# EAGLE design ISP (EAGLE 9.5.1)
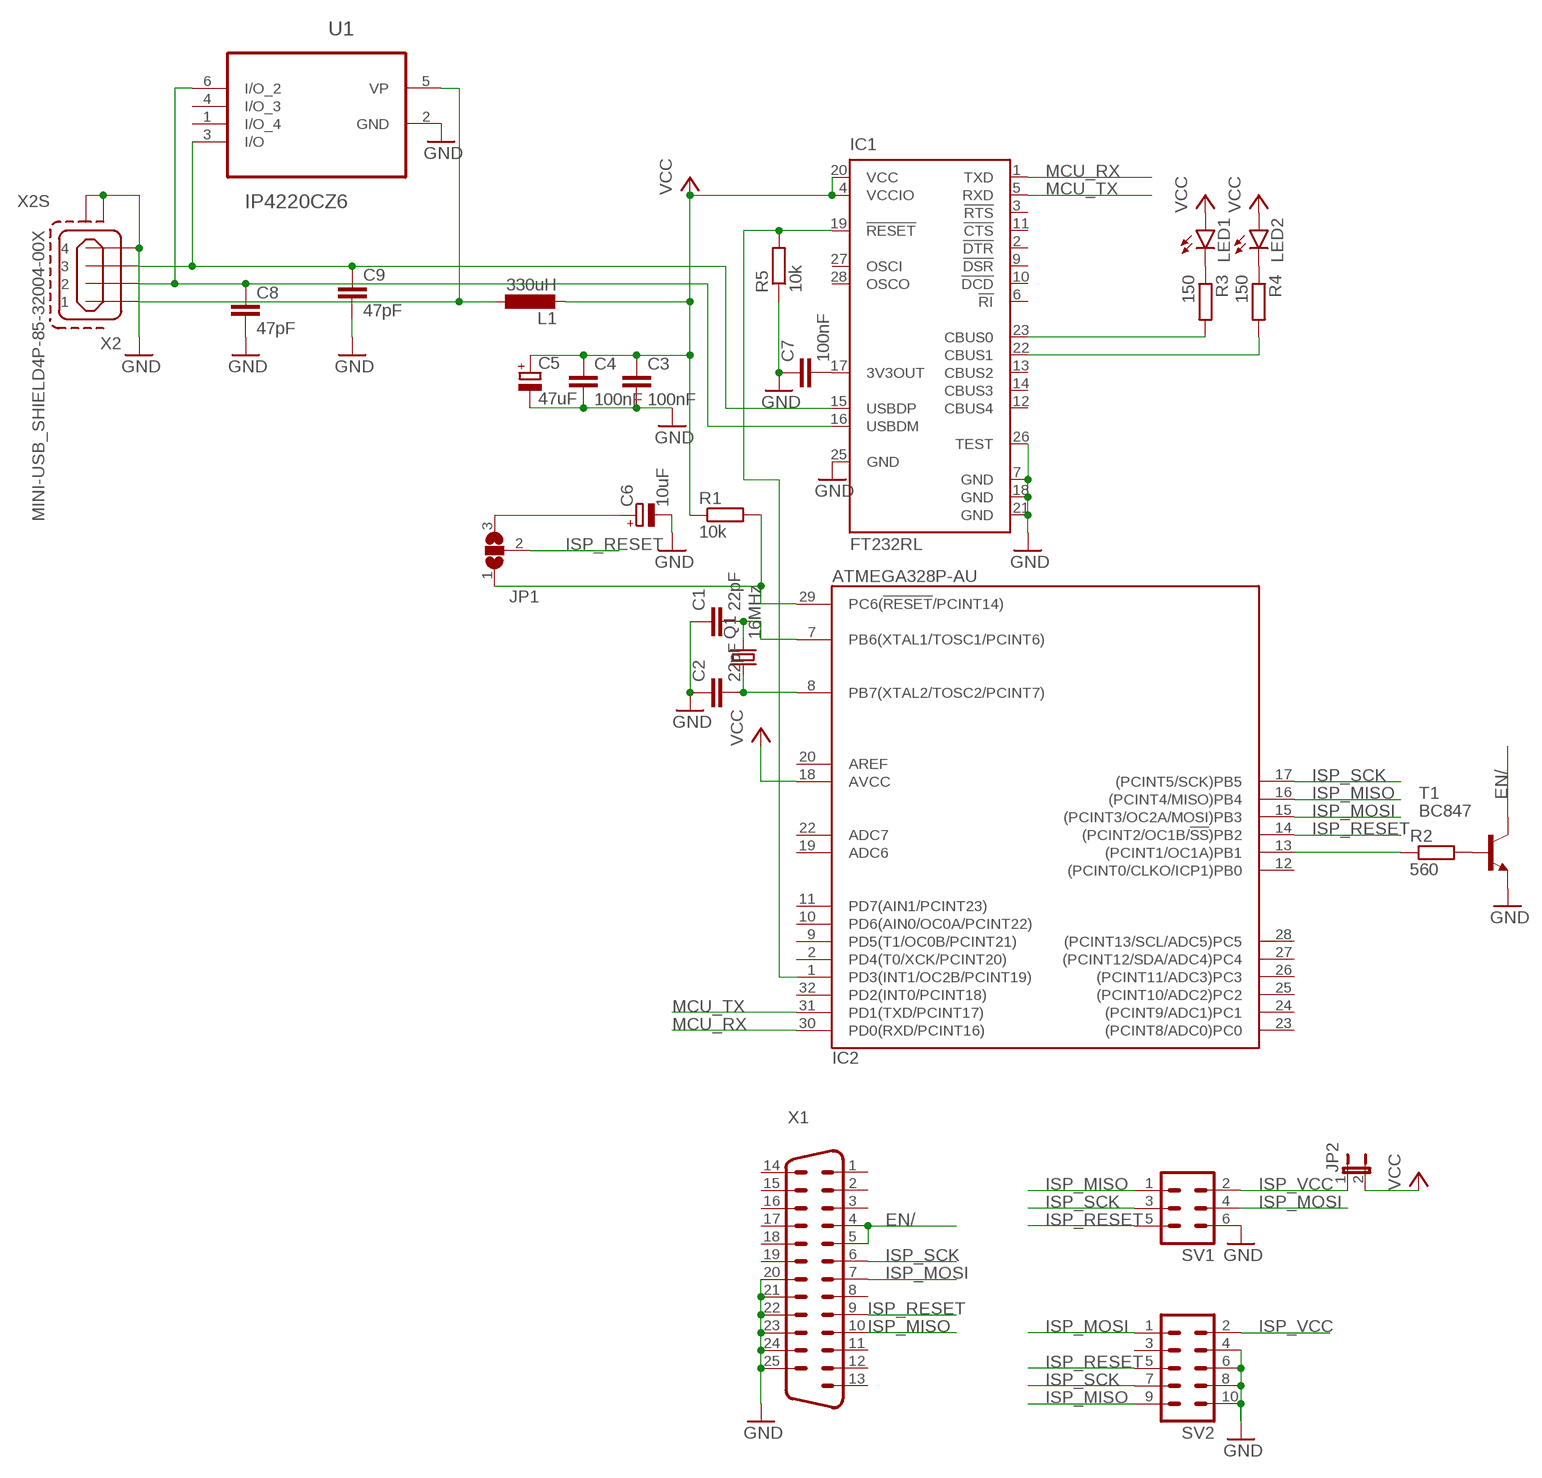
[diagram p0: schematic, sheet 1]

## Parts
C1  22pF  C-EUC0805  [C0805]
C2  22pF  C-EUC0805  [C0805]
C3  100nF  C-EUC0805  [C0805]
C4  100nF  C-EUC0805  [C0805]
C5  47uF  CPOL-EUD  [PANASONIC_D]
C6  10uF  CPOL-EUC  [PANASONIC_C]
C7  100nF  C-EUC0805  [C0805]
C8  47pF  C-EUC0805  [C0805]
C9  47pF  C-EUC0805  [C0805]
IC1  FT232RL  [SSOP28]
IC2  ATMEGA328P-AU  [QFP32_7X7_0.80]
JP1  SJ2W  [SJ_2]
JP2  JP1E  [JP1]
L1  330uH  L-EUL1812  [L1812]
LED1  LEDCHIPLED_1206  [CHIPLED_1206]
LED2  LEDCHIPLED_1206  [CHIPLED_1206]
Q1  16MHz  CRYSTALHC49UP  [HC49UP]
R1  10k  R-EU_R0805  [R0805]
R2  560  R-EU_R0805  [R0805]
R3  150  R-EU_R0805  [R0805]
R4  150  R-EU_R0805  [R0805]
R5  10k  R-EU_R0805  [R0805]
SV1  ML6  [ML6]
SV2  ML10  [ML10]
T1  BC847  [SOT23]
U1  IP4220CZ6  [SOT95P275X110-6N]
X1  M25HP  [M25HP]
X2  MINI-USB_SHIELD4P-85-32004-00X  [85-32004-00X]

## Nets
EN/: T1.3(C) X1.4 X1.5
GND: C1.1 C2.1 C3.2 C4.2 C5.- C6.- C7.1 C8.2 C9.2 IC1.7(GND) IC1.18(GND) IC1.21(GND) IC1.25(GND) IC1.26(TEST) R5.1 SV1.6 SV2.4 SV2.6 SV2.8 SV2.10 T1.2(E) U1.2(GND) X1.20 X1.21 X1.22 X1.23 X1.24 X1.25 X2.4 X2.M1(S1) X2.M2(S2)
ISP_MISO: IC2.16((PCINT4/MISO)PB4) SV1.1 SV2.9 X1.10
ISP_MOSI: IC2.15((PCINT3/OC2A/MOSI)PB3) SV1.4 SV2.1 X1.7
ISP_RESET: IC2.14((PCINT2/OC1B/!SS!)PB2) JP1.2 SV1.5 SV2.5 X1.9
ISP_SCK: IC2.17((PCINT5/SCK)PB5) SV1.3 SV2.7 X1.6
ISP_VCC: JP2.1 SV1.2 SV2.2
MCU_RX: IC1.1(TXD) IC2.30(PD0(RXD/PCINT16))
MCU_TX: IC1.5(RXD) IC2.31(PD1(TXD/PCINT17))
N$1: IC2.29(PC6(!RESET!/PCINT14)) JP1.1 R1.2
N$2: C6.+ JP1.3
N$3: C1.2 IC2.7(PB6(XTAL1/TOSC1/PCINT6)) Q1.2
N$4: C9.1 IC1.15(USBDP) U1.3(I/O) X2.3
N$5: IC2.13((PCINT1/OC1A)PB1) R2.1
N$6: R2.2 T1.1(B)
N$7: C8.1 IC1.16(USBDM) U1.6(I/O_2) X2.2
N$8: C7.2 IC1.17(3V3OUT)
N$9: C2.2 IC2.8(PB7(XTAL2/TOSC2/PCINT7)) Q1.1
N$10: LED2.C R4.1
N$11: LED1.C R3.1
N$12: IC1.23(CBUS0) R3.2
N$13: IC1.22(CBUS1) R4.2
N$14: L1.1 U1.5(VP) X2.1
N$15: IC1.19(!RESET) IC2.1(PD3(INT1/OC2B/PCINT19)) R5.2
VCC: C3.1 C4.1 C5.+ IC1.4(VCCIO) IC1.20(VCC) IC2.18(AVCC) JP2.2 L1.2 LED1.A LED2.A R1.1
Unconnected: IC1.2(!DTR) IC1.3(!RTS) IC1.6(!RI) IC1.9(!DSR) IC1.10(!DCD) IC1.11(!CTS) IC1.12(CBUS4) IC1.13(CBUS2) IC1.14(CBUS3) IC1.27(OSCI) IC1.28(OSCO) IC2.2(PD4(T0/XCK/PCINT20)) IC2.9(PD5(T1/OC0B/PCINT21)) IC2.10(PD6(AIN0/OC0A/PCINT22)) IC2.11(PD7(AIN1/PCINT23)) IC2.12((PCINT0/CLKO/ICP1)PB0) IC2.19(ADC6) IC2.20(AREF) IC2.22(ADC7) IC2.23((PCINT8/ADC0)PC0) IC2.24((PCINT9/ADC1)PC1) IC2.25((PCINT10/ADC2)PC2) IC2.26((PCINT11/ADC3)PC3) IC2.27((PCINT12/SDA/ADC4)PC4) IC2.28((PCINT13/SCL/ADC5)PC5) IC2.32(PD2(INT0/PCINT18)) SV2.3 U1.1(I/O_4) U1.4(I/O_3) X1.1 X1.2 X1.3 X1.8 X1.11 X1.12 X1.13 X1.14 X1.15 X1.16 X1.17 X1.18 X1.19

## Power pins joined to a net without a drawn wire
GND: IC2.3(GND) IC2.5(GND) IC2.21(GND)
VCC: IC2.4(VCC) IC2.6(VCC)

## Library data of the parts
C1-C4 C7-C9 = resistor:C-EU: CAPACITOR, European symbol
C5 C6 = resistor:CPOL-EU: POLARIZED CAPACITOR, European symbol
IC1 = ftdichip:FT232R: Source: http://www.ftdichip.com/Documents/DataSheets/DS_FT232R_v104.pdf; MPN: FT232RL; OC_FARNELL: 1146032; OC_NEWARK: 91K9918
IC2 = atmel:ATMEGA*8: 8-bit AVR Microcontroller 4/8/16/32 kbytes flash 512/1k/1k/2k bytes SRAM 256/512/512/1k bytes EEPROM USART, 6/8-channel 10 bit ADC Pin compatible with Atmega8(L,A) Note: ADC6 and ADC7 are not available in 28-lead packages
JP1 = jumper:SJ2W: SMD solder JUMPER
JP2 = jumper:JP1E: JUMPER
L1 = resistor:L-EU: INDUCTOR, European symbol
LED1 LED2 = led:LED: LED OSRAM: - CHIPLED LG R971, LG N971, LY N971, LG Q971, LY Q971, LO R971, LY R971 LH N974, LH R974 LS Q976, LO Q976, LY Q976 LO Q996 - Hyper CHIPLED LW Q18S LB Q993, LB Q99A, LB R99A - SideLED LS A670, LO A670, LY A670, LG A670, LP A670 LB A673, LV A673, LT A673, LW A673 LH A674 LY A675 LS A676, LA A676, LO A676, LY A676, LW A676 LS A679, LY A679, LG A679 - Hyper Micro SIDELED® LS Y876, LA Y876, LO Y876, LY Y876 LT Y87S - SmartLED LW L88C, LW L88S LB L89C, LB L89S, LG L890 LS L89K, LO L89K, LY L89K LS L896, LA L896, LO L896, LY L896 - TOPLED LS T670, LO T670, LY T670, LG T670, LP T670 LSG T670, LSP T670, LSY T670, LOP T670, LYG T670 LG T671, LOG T671, LSG T671 LB T673, LV T673, LT T673, LW T673 LH T674 LS T676, LA T676, LO T676, LY T676, LB T676, LH T676, LSB T676, LW T676 LB T67C, LV T67C, LT T67C, LS T67K, LO T67K, LY T67K, LW E67C LS E67B, LA E67B, LO E67B, LY E67B, LB E67C, LV E67C, LT E67C LW T67C LS T679, LY T679, LG T679 LS T770, LO T770, LY T770, LG T770, LP T770 LB T773, LV T773, LT T773, LW T773 LH T774 LS E675, LA E675, LY E675, LS T675 LS T776, LA T776, LO T776, LY T776, LB T776 LHGB T686 LT T68C, LB T68C - Hyper Mini TOPLED® LB M676 - Mini TOPLED Santana® LG M470 LS M47K, LO M47K, LY M47K Source: http://www.osram.convergy.de LUXEON: - LUMILED® LXK2-PW12-R00, LXK2-PW12-S00, LXK2-PW14-U00, LXK2-PW14-V00 LXK2-PM12-R00, LXK2-PM12-S00, LXK2-PM14-U00 LXK2-PE12-Q00, LXK2-PE12-R00, LXK2-PE12-S00, LXK2-PE14-T00, LXK2-PE14-U00 LXK2-PB12-K00, LXK2-PB12-L00, LXK2-PB12-M00, LXK2-PB14-N00, LXK2-PB14-P00, LXK2-PB14-Q00 LXK2-PR12-L00, LXK2-PR12-M00, LXK2-PR14-Q00, LXK2-PR14-R00 LXK2-PD12-Q00, LXK2-PD12-R00, LXK2-PD12-S00 LXK2-PH12-R00, LXK2-PH12-S00 LXK2-PL12-P00, LXK2-PL12-Q00, LXK2-PL12-R00 Source: www.luxeon.com KINGBRIGHT: KA-3528ASYC Source: www.kingbright.com
Q1 = crystal:CRYSTAL: CRYSTAL; OC_FARNELL: unknown; OC_NEWARK: unknown
R1-R5 = resistor:R-EU_: RESISTOR, European symbol
SV1 = con-harting-ml:ML6: HARTING; OC_FARNELL: unknown; OC_NEWARK: unknown
SV2 = con-ml:ML10: HARTING; OC_FARNELL: unknown; OC_NEWARK: unknown
T1 = transistor:BC847: NPN TRANSISTOR
U1 = IP4220CZ6:IP4220CZ6: Dual Schmitt-Trigger Inverter; MPN: IP4220CZ6; OC_FARNELL: 1506629; OC_NEWARK: 61M6815; PACKAGE: SSOT-6; SUPPLIER: NXP
X1 = con-subd:M25: SUB-D; OC_FARNELL: unknown; OC_NEWARK: unknown
X2 = con-cypressindustries:MINI-USB_SHIELD4P-: MINI USB 4 Pol. Source: www.cypressindustries.com; OC_FARNELL: unknown; OC_NEWARK: unknown

## Board
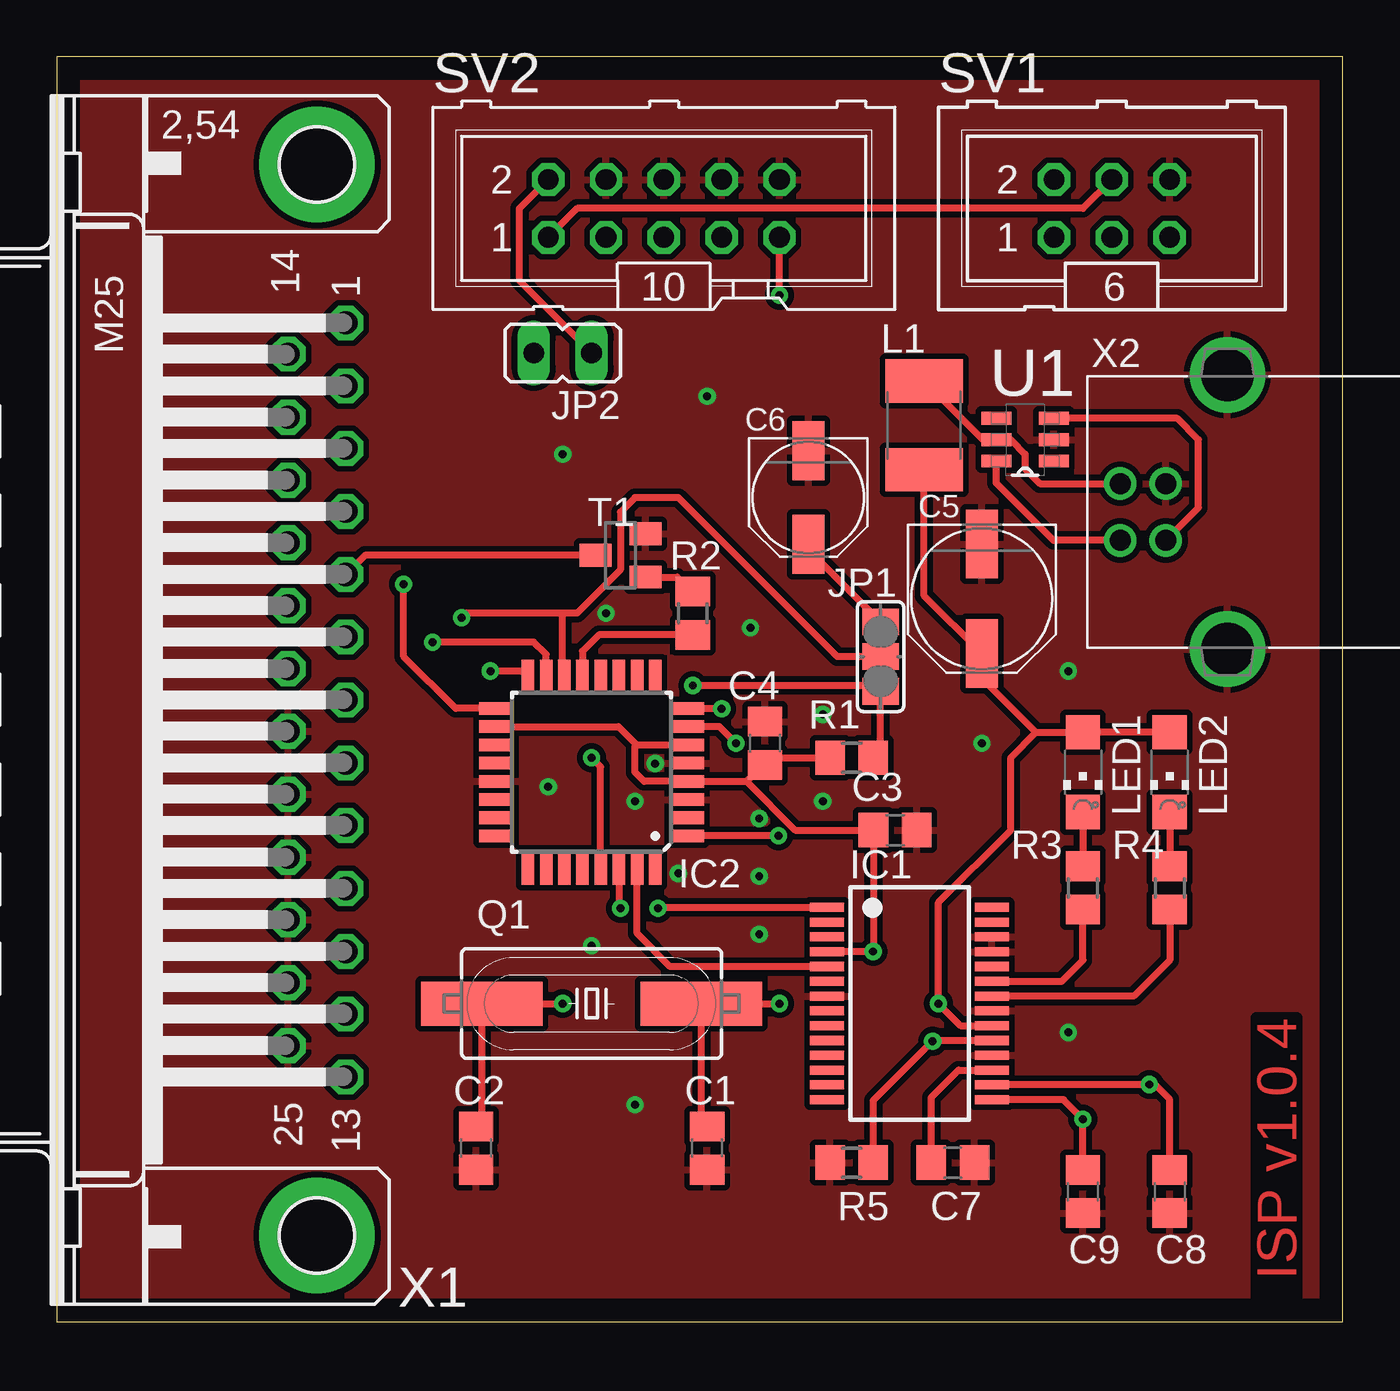
[diagram p1: board, top side]
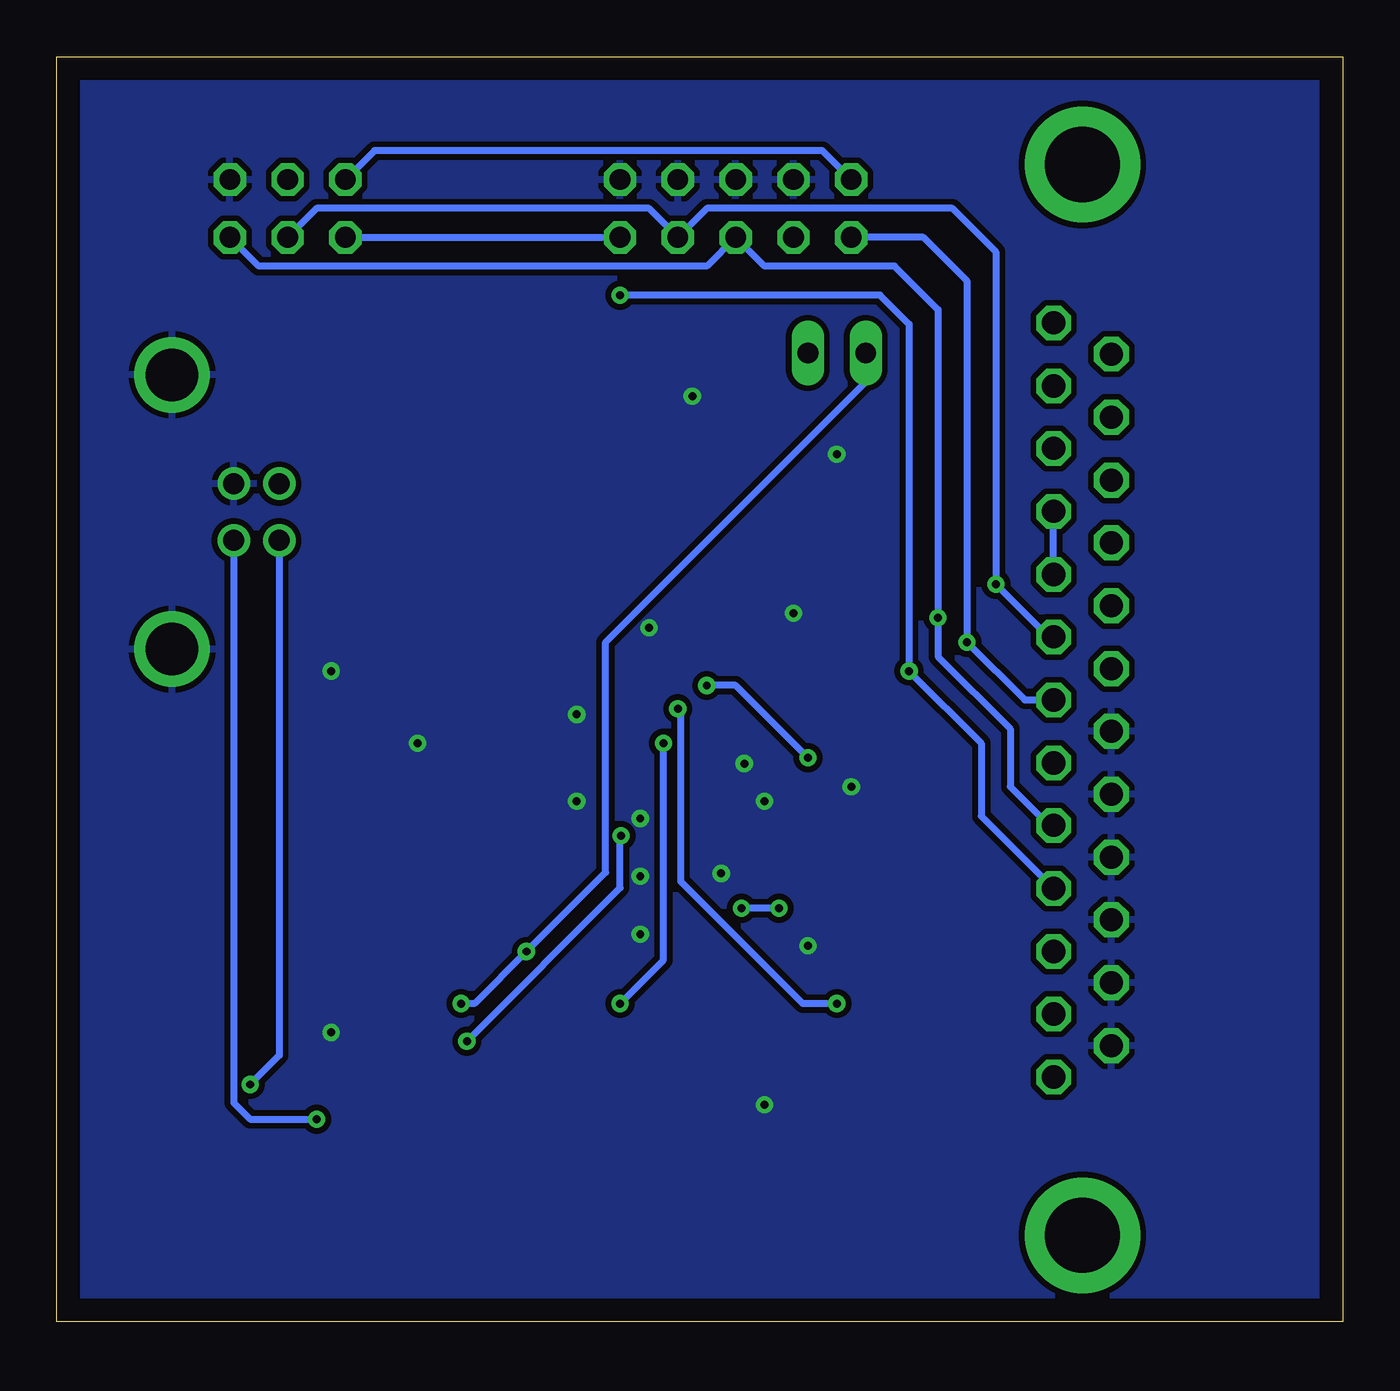
[diagram p2: board, bottom side, seen from below]

Size 56.5 x 55.55 mm. Coordinates in mm from the lower left corner, seen from the top.
Outline: 0,0 56.5,0 56.5,55.55 0,55.55 0,0
Copper layers (1*16): Top 0.035mm / dielectric 1.5mm / Bottom 0.035mm
Design rules "default": minimum track width 6mil, minimum drill 0.35mm, track to track 6mil, track to pad 6mil, pad to pad 6mil, via to via 6mil, smd to smd 6mil, copper to edge 40mil, drill to drill 6mil, minimum pad ring 10mil, minimum via ring 8mil, stop-mask expansion 4mil, vias tented up to drill 0mil, thermal gap 10mil

### Footprints (pad centres in the part's own frame; a part is rotated, then mirrored left to right if it is on the bottom)
C0805 = smd 1.3 x 1.5: 1 -0.95,0; 2 0.95,0
PANASONIC_D = smd 3 x 1.4: + 2.4,0; - -2.4,0
PANASONIC_C = smd 2.6 x 1.4: + 2.05,0; - -2.05,0
SSOP28 = smd 0.4 x 1.5: 1 -4.225,-3.625; 2 -3.575,-3.625; 3 -2.925,-3.625; 4 -2.275,-3.625; 5 -1.625,-3.625; 6 -0.975,-3.625; 7 -0.325,-3.625; 8 0.325,-3.625; 9 0.975,-3.625; 10 1.625,-3.625; 11 2.275,-3.625; 12 2.925,-3.625; 13 3.575,-3.625; 14 4.225,-3.625; 15 4.225,3.625; 16 3.575,3.625; 17 2.925,3.625; 18 2.275,3.625; 19 1.625,3.625; 20 0.975,3.625; 21 0.325,3.625; 22 -0.325,3.625; 23 -0.975,3.625; 24 -1.625,3.625; 25 -2.275,3.625; 26 -2.925,3.625; 27 -3.575,3.625; 28 -4.225,3.625
QFP32_7X7_0.80 = smd 1.5 x 0.55: 1 -4.2,2.8; 2 -4.2,2; 3 -4.2,1.2; 4 -4.2,0.4; 5 -4.2,-0.4; 6 -4.2,-1.2; 7 -4.2,-2; 8 -4.2,-2.8; 17 4.2,-2.8; 18 4.2,-2; 19 4.2,-1.2; 20 4.2,-0.4; 21 4.2,0.4; 22 4.2,1.2; 23 4.2,2; 24 4.2,2.8 | smd 0.55 x 1.5: 9 -2.8,-4.2; 10 -2,-4.2; 11 -1.2,-4.2; 12 -0.4,-4.2; 13 0.4,-4.2; 14 1.2,-4.2; 15 2,-4.2; 16 2.8,-4.2; 25 2.8,4.2; 26 2,4.2; 27 1.2,4.2; 28 0.4,4.2; 29 -0.4,4.2; 30 -1.2,4.2; 31 -2,4.2; 32 -2.8,4.2
SJ_2 = smd 1.168 x 1.6: 1 -1.524,0; 2 0,0; 3 1.524,0
JP1 = drill 0.914 long: 1 0,-1.27; 2 0,1.27
L1812 = smd 1.9 x 3.4: 1 -1.95,0; 2 1.95,0
CHIPLED_1206 = smd 1.5 x 1.5: A 0,-1.75; C 0,1.75
HC49UP = smd 5.334 x 1.93: 1 -4.826,0; 2 4.826,0
R0805 = smd 1.3 x 1.5: 1 -0.95,0; 2 0.95,0
ML6 = drill 0.914 octagon: 1 -2.54,-1.27; 2 -2.54,1.27; 3 0,-1.27; 4 0,1.27; 5 2.54,-1.27; 6 2.54,1.27
ML10 = drill 0.914 octagon: 1 -5.08,-1.27; 2 -5.08,1.27; 3 -2.54,-1.27; 4 -2.54,1.27; 5 0,-1.27; 6 0,1.27; 7 2.54,-1.27; 8 2.54,1.27; 9 5.08,-1.27; 10 5.08,1.27
SOT23 = smd 1 x 1.4: 1 -0.95,-1.1; 2 0.95,-1.1; 3 0,1.1
SOT95P275X110-6N = smd 1.321 x 0.559: 1 -1.27,0.94; 2 -1.27,0; 3 -1.27,-0.94; 4 1.27,-0.94; 5 1.27,0; 6 1.27,0.94
M25HP = drill 1.016 octagon: 1 -16.561,1.27; 2 -13.792,1.27; 3 -11.049,1.27; 4 -8.28,1.27; 5 -5.512,1.27; 6 -2.769,1.27; 7 0,1.27; 8 2.769,1.27; 9 5.512,1.27; 10 8.28,1.27; 11 11.049,1.27; 12 13.792,1.27; 13 16.561,1.27; 14 -15.189,-1.27; 15 -12.421,-1.27; 16 -9.652,-1.27; 17 -6.909,-1.27; 18 -4.14,-1.27; 19 -1.372,-1.27; 20 1.372,-1.27; 21 4.14,-1.27; 22 6.909,-1.27; 23 9.652,-1.27; 24 12.421,-1.27; 25 15.189,-1.27 | drill 3.302 pad 5.08: G1 -23.52,0; G2 23.52,0
85-32004-00X = drill 0.92 pad 1.27: 1 4.71,-1.25; 2 4.71,1.25; 3 2.71,1.25; 4 2.71,-1.25 | drill 2.3 pad 3: M1 0,6.02; M2 0,-6.02

### Placement (x,y rotation side)
C1  28.57,7.62 90 top
C2  18.41,7.62 90 top
C3  36.83,21.59 0 top
C4  31.11,25.4 90 top
C5  40.64,31.75 270 top
C6  33.02,36.2 270 top
C7  39.37,6.99 180 top
C8  48.9,5.71 270 top
C9  45.09,5.71 270 top
IC1  37.47,13.97 270 top
IC2  23.49,24.13 180 top
JP1  36.2,29.21 90 top
JP2  22.22,42.55 90 top
L1  38.1,39.37 270 top
LED1  45.09,24.13 180 top
LED2  48.9,24.13 180 top
Q1  23.49,13.97 0 top
R1  34.93,24.77 0 top
R2  27.94,31.11 90 top
R3  45.09,19.05 270 top
R4  48.9,19.05 270 top
R5  34.93,6.99 0 top
SV1  46.36,48.9 0 top
SV2  26.67,48.9 0 top
T1  24.76,33.66 90 top
U1  42.55,38.73 180 top
X1  11.43,27.3 270 top
X2  51.44,35.56 180 top

### Tracks (layer width: path | path; a pad name or v marks a point on that pad's centre or on a via)
EN/
  Top 0.305: X1.5 13.54,33.66 T1.3
  Bottom 0.305: X1.5 X1.4
GND  (via drill 0.35)
  other vias: 21.59,23.5 25.4,22.86 27.3,19.68 30.48,30.48 24.13,31.11 25.4,9.53 23.49,16.51 33.66,26.67 22.22,38.1 28.57,40.64 33.66,22.86 40.64,25.4 44.45,28.57 44.45,12.7 26.29,24.51 30.86,22.1 30.86,19.56 30.86,17.02
  pour Bottom (isolate 0.254): -0.64,55.24 56.52,55.24 56.52,0 -0.64,0
  pour Top (isolate 0.254): -1.27,55.24 57.15,55.24 57.15,0 -1.27,0
ISP_MISO  (via drill 0.35)
  Top 0.305: IC2.16 20.45,28.57 v19.05,28.57 | v31.75,45.09 SV2.9
  Bottom 0.305: SV1.1 SV2.9 | v31.75,45.09 20.32,45.09 19.05,43.81 v19.05,28.57 15.88,25.4 15.88,22.2 X1.10
ISP_MOSI  (via drill 0.35)
  Top 0.305: SV1.4 45.09,48.9 22.86,48.9 SV2.1 | IC2.15 21.49,29.3 20.95,29.84 v16.51,29.84
  Bottom 0.305: SV2.1 18.41,47.62 16.51,45.72 v16.51,29.84 13.97,27.3 X1.7
ISP_RESET  (via drill 0.35)
  Top 0.305: IC2.14 22.22,28.4 22.22,31.11 | v17.78,30.91 17.98,31.11 22.22,31.11 | JP1.2 34.29,29.21 27.3,36.2 25.4,36.2 24.76,35.56 24.76,33.02 22.86,31.11 22.22,31.11
  Bottom 0.305: SV1.5 47.62,46.35 27.94,46.35 SV2.5 25.4,46.35 19.68,46.35 17.78,44.45 v17.78,30.91 17.78,29.21 14.61,26.04 14.61,23.5 12.9,21.79 X1.9
ISP_SCK  (via drill 0.35)
  Top 0.305: IC2.17 17.52,26.93 15.24,29.21 v15.24,32.38
  Bottom 0.305: SV1.3 45.09,48.9 30.48,48.9 SV2.7 27.94,48.9 17.14,48.9 15.24,46.99 v15.24,32.38 12.93,30.07 X1.6
ISP_VCC
  Top 0.305: JP2.1 20.32,45.72 20.32,48.9 SV2.2
  Bottom 0.305: SV2.2 22.86,51.44 42.55,51.44 SV1.2
MCU_RX  (via drill 0.35)
  Top 0.305: IC2.30 24.69,18.23 v24.76,18.16 | v26.42,18.16 26.45,18.2 IC1.1
  Bottom 0.305: v24.76,18.16 v26.42,18.16
MCU_TX
  Top 0.305: IC1.5 26.95,15.6 25.49,17.05 IC2.31
N$1  (via drill 0.35)
  Top 0.305: IC2.29 23.89,24.36 v23.49,24.77 | v27.94,27.94 35.94,27.94 JP1.1 36.2,25.18 R1.2
  Bottom 0.305: v27.94,27.94 26.67,27.94 v23.49,24.77
N$2
  Top 0.305: C6.+ 33.02,33.91 JP1.3
N$3  (via drill 0.35)
  Top 0.305: C1.2 28.32,8.58 Q1.2 v31.75,13.97 | v29.84,25.4 29.11,26.13 IC2.7
  Bottom 0.305: v31.75,13.97 29.84,15.88 v29.84,25.4
N$4  (via drill 0.35)
  Top 0.305: IC1.15 44.23,9.74 v45.09,8.89 C9.1 | X2.3 50.16,35.75 50.16,38.73 49.23,39.67 U1.3
  Bottom 0.305: X2.3 48.73,9.61 48.01,8.89 v45.09,8.89
N$5
  Top 0.305: R2.1 23.81,30.16 23.09,29.45 IC2.13
N$6
  Top 0.305: T1.1 27.25,32.7 R2.2
N$7  (via drill 0.35)
  Top 0.305: 47.99,10.39 48.26,10.39 48.9,9.76 C8.1 | 47.99,10.39 IC1.16 | v48.01,10.41 47.99,10.39 | X2.2 43.8,34.31 41.27,36.83 U1.6
  Bottom 0.305: X2.2 46.73,11.7 v48.01,10.41
N$8
  Top 0.305: C7.2 38.42,9.85 39.62,11.04 IC1.17
N$9  (via drill 0.35)
  Top 0.305: C2.2 18.67,8.58 Q1.1 v22.22,13.97 | v29.21,26.92 IC2.8
  Bottom 0.305: v22.22,13.97 23.72,13.97 29.08,19.34 29.08,26.8 v29.21,26.92
N$10
  Top 0.305: LED2.C R4.1
N$11
  Top 0.305: LED1.C R3.1
N$12
  Top 0.305: IC1.23 44.16,14.95 45.09,15.88 R3.2
N$13
  Top 0.305: R4.2 48.9,15.88 47.32,14.29 IC1.22
N$14
  Top 0.305: L1.1 40.69,38.73 U1.5 41.91,38.73 42.55,38.1 42.55,37.47 43.2,36.81 X2.1
N$15  (via drill 0.35)
  Top 0.305: IC1.19 38.51,12.35 v38.48,12.32 35.88,9.71 R5.2 | v31.7,21.34 IC2.1
  Bottom 0.305: v38.48,12.32 31.75,19.05 31.75,21.29 v31.7,21.34
VCC  (via drill 0.35)
  Top 0.305: IC2.18 24.67,26.13 25.47,25.33 | 25.47,25.33 IC2.6 | 25.47,25.33 25.4,25.26 25.4,24.13 25.8,23.73 IC2.4 30.29,23.73 | 30.29,23.73 C4.1 31.33,24.77 R1.1 | 30.29,23.73 32.44,21.59 C3.1 35.88,16.27 v35.87,16.26 35.85,16.25 IC1.4 | IC1.20 39.71,12.99 v38.73,13.97 38.73,18.41 41.91,21.59 41.91,24.77 43.02,25.88 | LED2.A LED1.A 43.02,25.88 | 43.02,25.88 40.64,28.27 C5.+ 38.1,31.89 L1.2
  Bottom 0.305: JP2.2 20.95,41.27 32.39,29.84 32.39,19.74 v35.87,16.26 38.15,13.97 v38.73,13.97

### Text on the board
Top: ISP v1.0.4